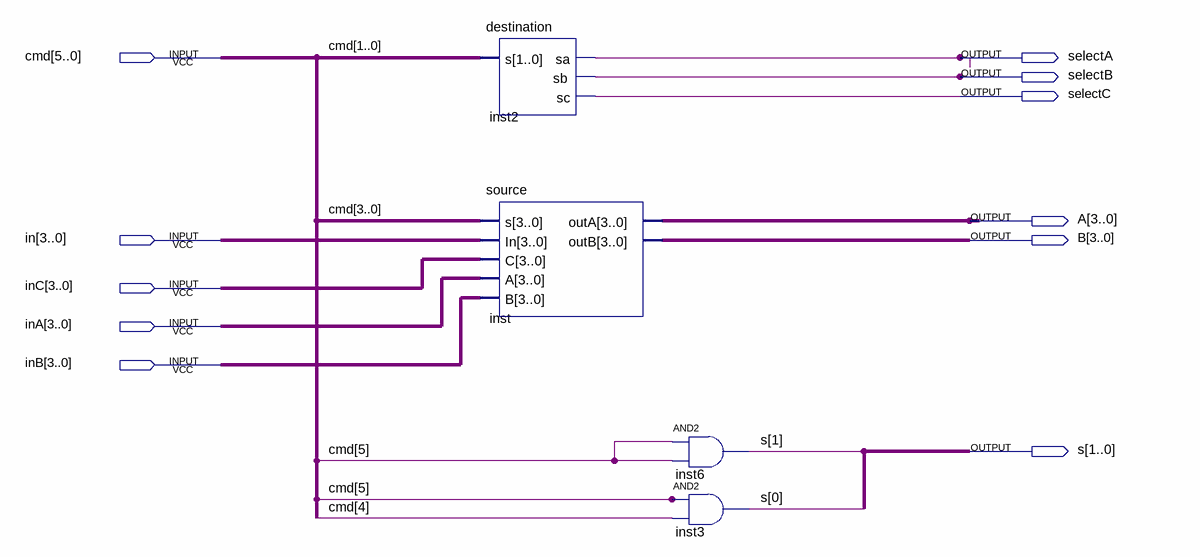
[diagram p0: schematic sheet]
// Quartus schematic DecodingCircuit.bdf as structural Verilog: 4 symbols, 11 pins
module DecodingCircuit (
  input  [5:0] cmd,
  input  [3:0] in,
  input  [3:0] inC,
  input  [3:0] inA,
  input  [3:0] inB,
  output selectA,
  output selectB,
  output selectC,
  output [3:0] A,
  output [3:0] B,
  output [1:0] s
);

  destination inst2 (.s(cmd[1:0]), .sa(selectA), .sb(selectB), .sc(selectC));
  source inst (.s(cmd[3:0]), .In(in), .C(inC), .A(inA), .B(inB), .outA(A), .outB(B));
  and inst6 (s[1], cmd[5], cmd[5]);
  and inst3 (s[0], cmd[5], cmd[4]);
endmodule
